# Altium schematic sheet 1_P1.schdoc
size 307 x 218 mm; Symbol: Drawing-Symbol_A4; Device: Drawing-Symbol_A4; @Project Name: LED DICE GAME; @Page Count: 1; @Update Date: 2025-03-24; @Create Date: 2025-03-24; @Schematic Name: Schematic1; @Page No: 1; @Page Name: P1; Company: EasyEDA.com; Version: V1.0; Page Size: A4; @Create Time: 15:20:08; @Update Time: 20:12:12; Width: 1170; Height: 825; Region Start: 1; X Region Count: 6; Y Region Count: 4; Blade Width: 10; Title Block Position: 3; @Board Name: PCB2; SheetNumber: 1; SheetTotal: 1
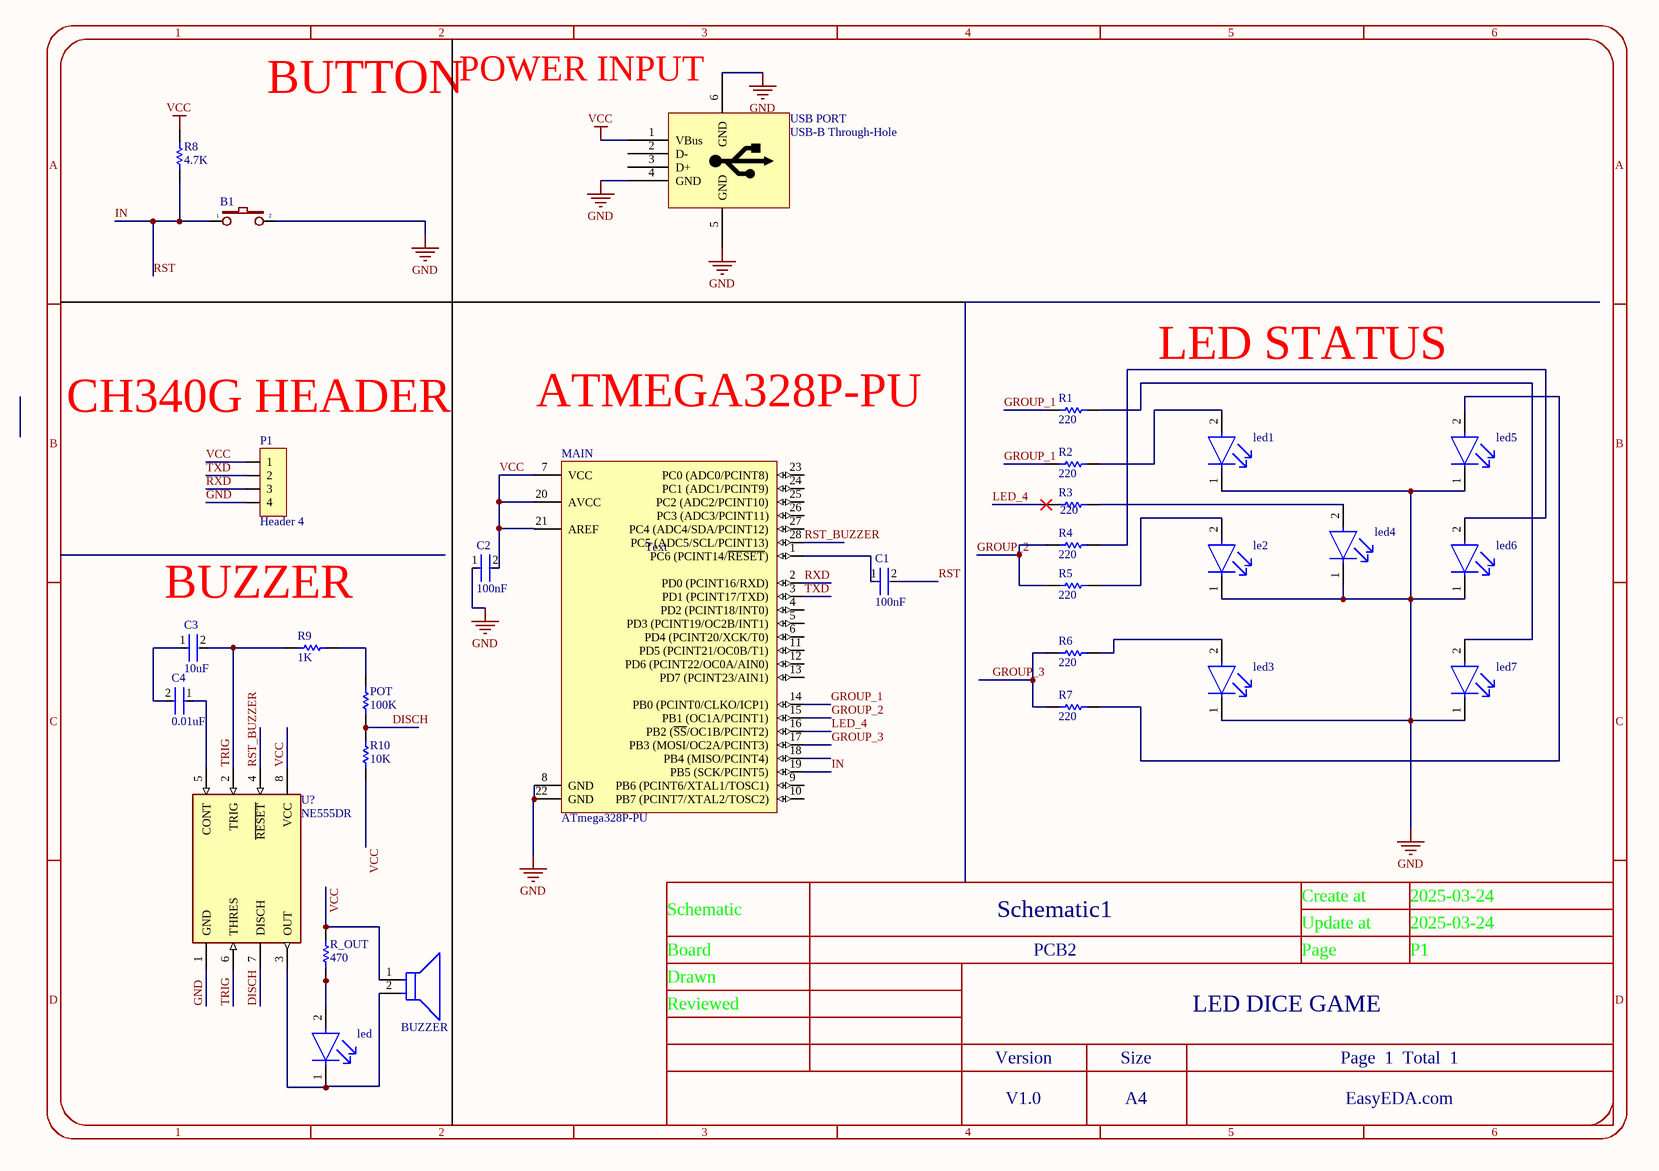
[diagram p0: 1_P1.schdoc]

## Parts
?  BUZZER  [FP-SD1209-MFG]
B1  (no value)  [SW2]
C1  100nF  [FP-C0402-BB-MFG]
C2  100nF  [FP-C0402-BB-MFG]
C3  10uF  [FP-C0402-BB-MFG]
C4  0.01uF  [FP-C0402-BB-MFG]
le2  (no value)  [FP-HLMP-1719-MFG]
led  (no value)  [FP-HLMP-1719-MFG]
led1  (no value)  [FP-HLMP-1719-MFG]
led3  (no value)  [FP-HLMP-1719-MFG]
led4  (no value)  [FP-HLMP-1719-MFG]
led5  (no value)  [FP-HLMP-1719-MFG]
led6  (no value)  [FP-HLMP-1719-MFG]
led7  (no value)  [FP-HLMP-1719-MFG]
MAIN  ATmega328P-PU  [28P3]
P1  Header 4  [HDR/Header/4/2mm]
POT  100K  [RESC1609X50X30NL8T20]
R1  220  [RESC1609X50X30NL8T20]
R2  220  [RESC1609X50X30NL8T20]
R3  220  [RESC1609X50X30NL8T20]
R4  220  [RESC1609X50X30NL8T20]
R5  220  [RESC1609X50X30NL8T20]
R6  220  [RESC1609X50X30NL8T20]
R7  220  [RESC1609X50X30NL8T20]
R8  4.7K  [RESC1609X50X30NL8T20]
R9  1K  [RESC1609X50X30NL8T20]
R10  10K  [RESC1609X50X30NL8T20]
R_OUT  470  [RESC1609X50X30NL8T20]
U?  NE555DR  [FP-D0008A-IPC_A]
USB_PORT  USB-B Through-Hole  [USB2.5-2H4D]

## Nets
GND: B1.2 C2.1 le2.1(C) led1.1(C) led3.1(C) led4.1(C) led5.1(C) led6.1(C) led7.1(C) MAIN.8(GND) MAIN.22(GND) P1.4 U?.1(GND) USB_PORT.4(GND) USB_PORT.5(GND) USB_PORT.6(GND)
VCC: ?.1(C) C2.2 MAIN.7(VCC) MAIN.20(AVCC) MAIN.21(AREF) P1.1 R8.2 R10.2 R_OUT.1 U?.8(VCC) USB_PORT.1(VBus)
DISCH: POT.1 R10.1 U?.7(DISCH)
GROUP_1: MAIN.14(PB0_(PCINT0/CLKO/ICP1)) R1.1 R2.1
GROUP_2: MAIN.15(PB1_(OC1A/PCINT1)) R4.1 R5.1
GROUP_3: MAIN.17(PB3_(MOSI/OC2A/PCINT3)) R6.1 R7.1
IN: B1.1 C1.2 MAIN.19(PB5_(SCK/PCINT5)) R8.1  [also labelled RST]
LED_4: MAIN.16(PB2_(~{SS}/OC1B/PCINT2)) R3.1
RST_BUZZER: MAIN.28(PC5_(ADC5/SCL/PCINT13)) U?.4(~{RESET})
RXD: MAIN.2(PD0_(PCINT16/RXD)) P1.3
TRIG: C3.2 R9.2 U?.2(TRIG) U?.6(THRES)
TXD: MAIN.3(PD1_(PCINT17/TXD)) P1.2
Net?_2: ?.2(A) led.1(C) U?.3(OUT)
NetC1_1: C1.1 MAIN.1(PC6_(PCINT14/~{RESET}))
NetC3_1: C3.1 C4.2
NetC4_1: C4.1 U?.5(CONT)
Netle2_2: le2.2(A) R5.2
Netled1_2: led1.2(A) R2.2
Netled3_2: led3.2(A) R6.2
Netled4_2: led4.2(A) R3.2
Netled5_2: led5.2(A) R7.2
Netled6_2: led6.2(A) R4.2
Netled7_2: led7.2(A) R1.2
Netled_2: led.2(A) R_OUT.2
NetPOT_2: POT.2 R9.1

Not connected (* = marked no-connect by the designer): MAIN 4(PD2_(PCINT18/INT0)) 5(PD3_(PCINT19/OC2B/INT1)) 6(PD4_(PCINT20/XCK/T0)) 9(PB6_(PCINT6/XTAL1/TOSC1)) 10(PB7_(PCINT7/XTAL2/TOSC2)) 11(PD5_(PCINT21/OC0B/T1)) 12(PD6_(PCINT22/OC0A/AIN0)) 13(PD7_(PCINT23/AIN1)) 18(PB4_(MISO/PCINT4)) 23(PC0_(ADC0/PCINT8)) 24(PC1_(ADC1/PCINT9)) 25(PC2_(ADC2/PCINT10)) 26(PC3_(ADC3/PCINT11)) 27(PC4_(ADC4/SDA/PCINT12)); USB_PORT 2(D-) 3(D+)

## Notes on the sheet
- BUTTON
- (near USB_PORT) POWER INPUT
- ATMEGA328P-PU
- LED STATUS
- (near P1) CH340G HEADER
- BUZZER
- (near MAIN) Text
- 1
- 2
- 3
- 4
- 5
- 6
- A
- B
- C
- Schematic
- Schematic1
- Create at
- Update at
- 2025-03-24
- Board
- Drawn
- PCB2
- Page
- P1
- D
- Reviewed
- Version
- Size
- LED DICE GAME
- Page  1  Total  1
- V1.0
- A4
- EasyEDA.com

## Library data of the parts
? = CMP-08413-000009-1: AUDIO MAGNETIC XDCR 3-6V TH; Max Supply Current: 60mA; Number of Terminals/Pins: 2; Frequency: 2.048kHz; Washable: No; Operating Supply Voltage: 5V; Self Resonant Frequency: 2.05kHz; Min Operating Temperature: -40°C; Operating Supply Current: 60mA; Diameter: 12mm; Package Quantity: 100; Max Operating Temperature: 85°C; Sensing Method: Magnetic; Series: SD; Current Rating: 60mA; Lead Free: Lead Free; Height: 9mm; Packaging: Tray; Termination: PC Pins; Number of Pins: 2; Voltage Rating (DC): 5V; Mount: Through Hole
B1 = SW2: Switch button 2 pin; Value: SW chip 2 pin
C1-C4 = CMP-2008-02046-2: CAP CER 0.1UF 10V X5R 0402; Manufacturer: Kemet; Manufacturer Part Number: C0402C104K8PACTU; Material: Ceramic; Capacitance: 0.10 μF; Temperature Coefficient: 15%; Tolerance: 0.1; Value: 0.10 μF; Package: C0402-BB; Temperature: -55°C to +125°C; ComponentLink2Description: Datasheet; Temperature Characteristic: X5R; Device Class L1: Passive Components; Height: 0.55mm; Lead Free: Yes; ComponentLink2URL: https://content.kemet.com/datasheets/KEM_C1002_X7R_SMD.pdf; Device Class L2: Capacitors; Temperature Range Low: -55°C; Temperature Range High: +125°C; RoHS: TRUE; Octopart: https://octopart.com/c0402c104k8pactu-kemet-140039; Automotive: No; Mouser Description: Capacitor 100 nF 10 VDC 0402; Category: Cap; Voltage Rating: 10 V; Digikey Description: CAP CER 0.1UF 10V X5R 0402; Ipc Land Pattern Name: CAPC10050X50; Device Class L3: Ceramic Capacitors
le2 led led1 led3-led7 = CMP-2000-06410-2: LED YELLOW DIFFUSED T-1 T/H; Manufacturer: Broadcom; Wavelength: 585nm; Led Orientation: Straight; Luminous Intensity: 2.1mcd; Forward Voltage: 1.8V; Viewing Angle: 50°; Reverse Voltage: 5V; Power Dissipation: 17.5mW; Forward Current: 2mA; Lead Free: Yes; Automotive: No; Device Class L1: Optoelectronics; Mouser Description: Standard LEDs - Through Hole Yellow Diffused 585nm 2.1mcd; Digikey Description: LED YELLOW DIFFUSED T-1 T/H; Temperature: -40°C to +100°C; Temperature Range High: +100°C; Package: 0; Category: Diode; Colour: Yellow; Device Class L2: LEDs; ComponentLink2Description: Datasheet; ComponentLink2URL: https://docs.broadcom.com/docs/AV02-1557EN; Temperature Range Low: -40°C; Device Class L3: unset; Octopart: https://octopart.com/hlmp-1719-broadcom-71130405; RoHS: TRUE; Manufacturer Part Number: HLMP-1719
MAIN = CMP-0095-00013-2: 8-bit AVR Microcontroller, 32KB Flash, 1KB EEPROM, 2KB SRAM, 28-pin PDIP, Industrial Grade (-40°C to 85°C); RevisionNote: DatasheetVersion updated. URLs added.; PackageVersion: revB, Sep-2001; PackageDescription: 28-lead (0.300"/7.62mm Wide) Plastic Dual Inline Package (PDIP); DatasheetVersion: revD, May-2011; ComponentLink1Description: Manufacturer URL; ComponentLink1URL: http://www.atmel.com/; PackageReference: 28P3; ComponentLink2Description: ATmega48A/48PA/88A/88PA/168A/168PA/328/328P Datasheet; ComponentLink3URL: http://www.atmel.com/dyn/resources/prod_documents/8271S.pdf; ComponentLink2URL: http://www.atmel.com/dyn/resources/prod_documents/8271.pdf; ComponentLink3Description: ATmega48A/48PA/88A/88PA/168A/168PA/328/328P Summary
P1 = Header 4: Header, 4-Pin
POT R1-R10 R_OUT = CMP-1666-00005-4: Chip Resistor, 10 KOhm, +/- 1%, 100 mW, -55 to 155 degC, 0603 (1608 Metric), RoHS, Tape and Reel; Manufacturer: Vishay Semiconductor; Voltage Rating: 75 V; Max Operating Temperature: 155 degC; PackageDescription: 2-Pin Surface Mount Device, Body 1.575 x 0.85 mm; ComponentLink1Description: Manufacturer URL; RoHSCompliant: true; PackageReference: 0603; REACH SVHC: Unknown; Length: 1.55 mm; DatasheetVersion: 06/2012; Packaging: Tape and Reel; Min Operating Temperature: -55 degC; Mounting Technology: Surface Mount; ComponentLink2URL: https://datasheet.ciiva.com/11809/0900766b80d98afc-11809037.pdf; Height: 0.45 mm; ComponentLink2Description: Datasheet; Package Quantity: 5000; ComponentLink1URL: http://www.vishay.com/
U? = CMP-1685-00007-2: IC OSC SGL TIMER 100KHZ 8-SOIC; Low Level Output Current: 200mA; Quiescent Current: 15mA; Min Supply Voltage: 4.5V; Number of Timers/Counters: 1; Max Supply Voltage: 16V; Operating Supply Current: 10mA; High Level Output Current: -200mA; Packaging: Tape and Reel; Frequency: 100kHz; Weight: 0.002561oz; REACH SVHC: No SVHC; Package Quantity: 2500; Width: 3.91mm; Max Operating Temperature: 70°C; Contact Plating: Gold; Lead Free: Lead Free; Number of Pins: 8; Min Operating Temperature: 0°C; Radiation Hardening: No; Length: 4.9mm; Case/Package: SOIC; Height: 1.58mm; Mount: Surface Mount
USB_PORT = USB-B TH